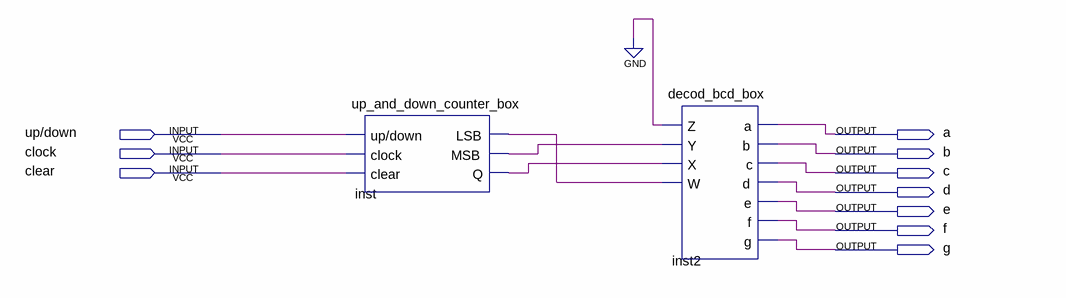
[diagram p0: schematic sheet]
// Quartus schematic up_and_down_counter.bdf as structural Verilog: 2 symbols, 10 pins
module up_and_down_counter (
  input  \up/down ,
  input  clock,
  input  clear,
  output a,
  output b,
  output c,
  output d,
  output e,
  output f,
  output g
);

  wire inst_lsb, inst_msb, inst_q;

  up_and_down_counter_box inst (
    .\up/down (\up/down ), .clock(clock), .clear(clear), .LSB(inst_lsb), .MSB(inst_msb), .Q(inst_q));
  decod_bcd_box inst2 (
    .Z(1'b0), .Y(inst_msb), .X(inst_q), .W(inst_lsb), .a(a), .b(b), .c(c), .d(d), .e(e), .f(f), .g(g));
endmodule
